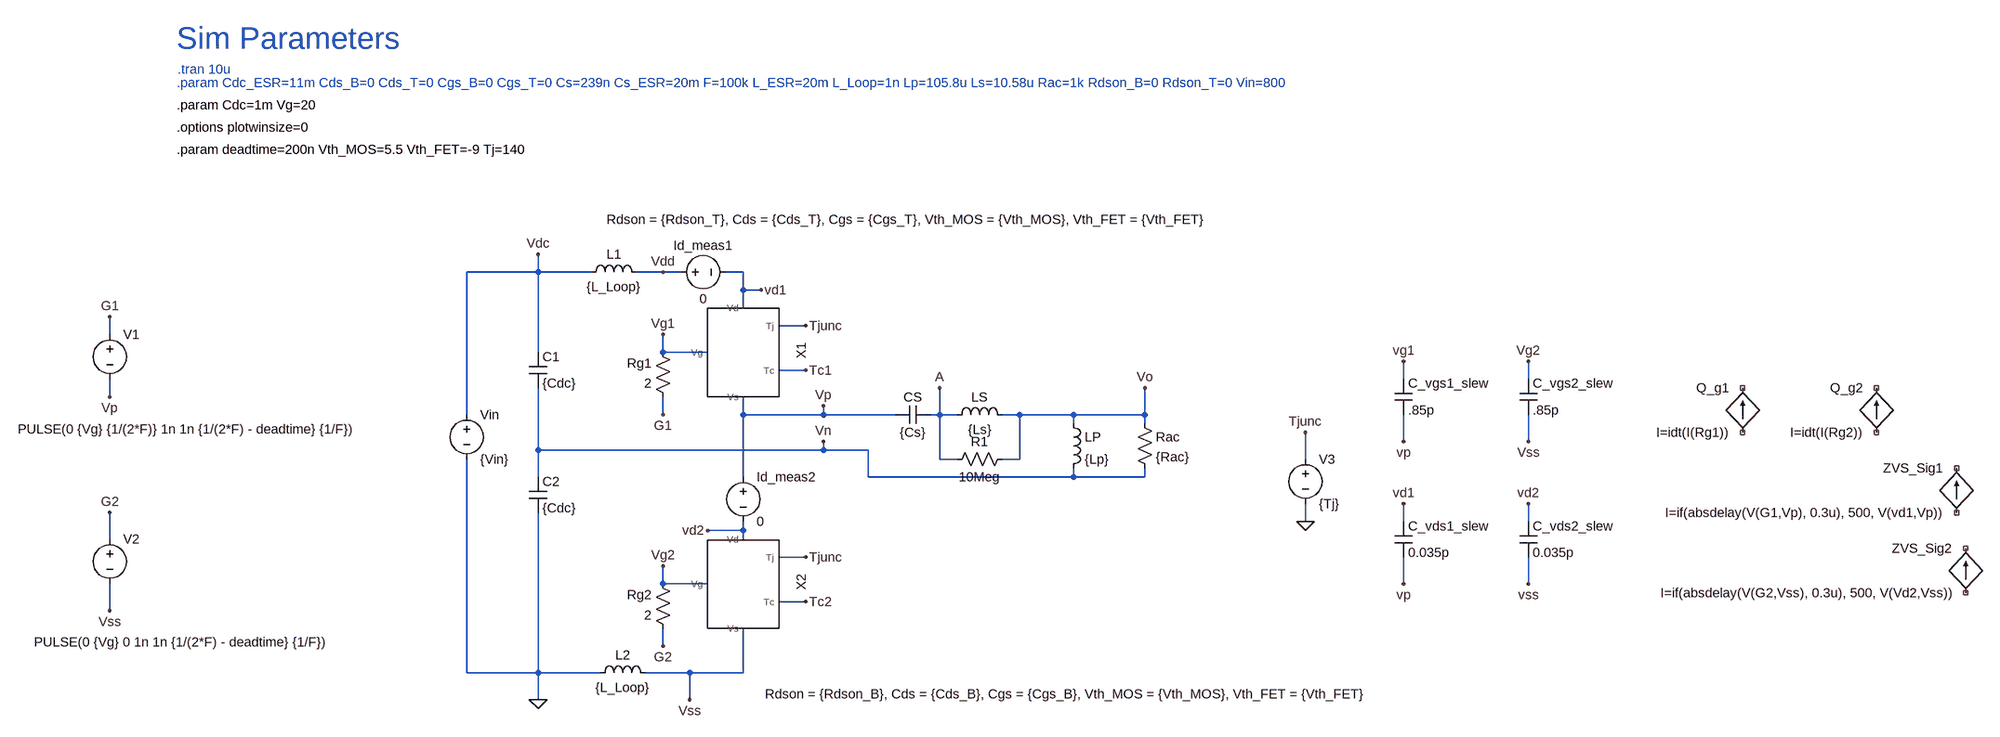
[diagram p0: schematic MainCircuit.asc]
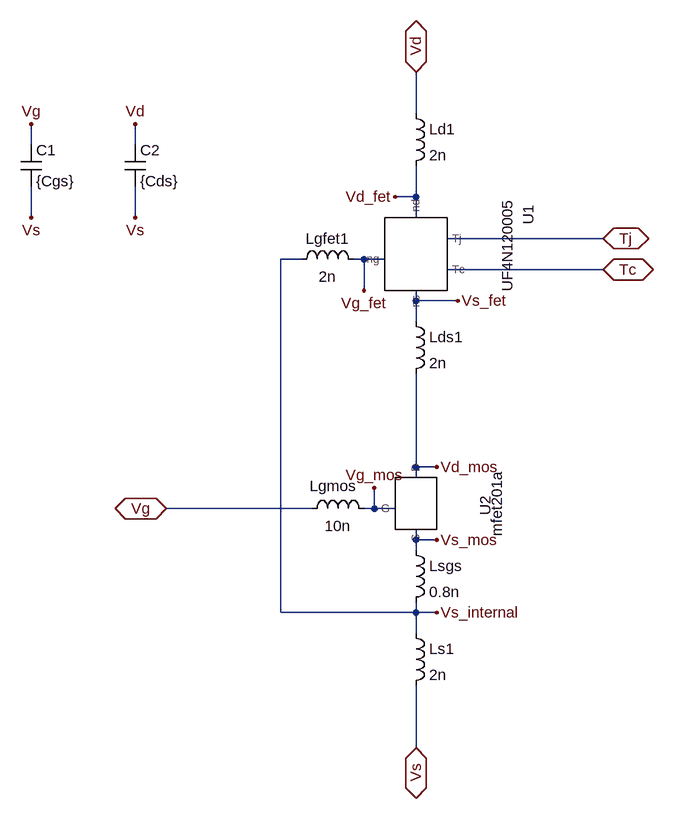
[diagram p1: sub-circuit ccjfet.asc]
MainCircuit.asc, the LTspice schematic file:
Version 4
SHEET 1 3076 1788
WIRE -1248 272 -1248 240
WIRE -1248 272 -1376 272
WIRE -1152 272 -1248 272
WIRE -1024 272 -1072 272
WIRE -992 272 -1024 272
WIRE -880 272 -912 272
WIRE -880 304 -880 272
WIRE -848 304 -880 304
WIRE -880 336 -880 304
WIRE -768 368 -816 368
WIRE -2016 384 -2016 352
WIRE -1248 416 -1248 272
WIRE -1024 416 -1024 384
WIRE -944 416 -1024 416
WIRE -768 448 -816 448
WIRE 304 464 304 432
WIRE 528 464 528 432
WIRE -2016 496 -2016 464
WIRE -1376 528 -1376 272
WIRE -1024 528 -1024 496
WIRE -880 528 -880 496
WIRE -736 528 -736 512
WIRE -736 528 -880 528
WIRE -608 528 -736 528
WIRE -528 528 -528 480
WIRE -528 528 -544 528
WIRE -496 528 -528 528
WIRE -384 528 -416 528
WIRE -288 528 -384 528
WIRE -160 528 -160 480
WIRE -160 528 -288 528
WIRE -288 544 -288 528
WIRE -160 544 -160 528
WIRE 304 576 304 528
WIRE 528 576 528 528
WIRE -1248 592 -1248 480
WIRE -736 592 -736 576
WIRE -736 592 -1248 592
WIRE -656 592 -736 592
WIRE -528 608 -528 528
WIRE -496 608 -528 608
WIRE -384 608 -384 528
WIRE -384 608 -416 608
WIRE 128 608 128 560
WIRE -1248 640 -1248 592
WIRE -880 640 -880 528
WIRE -656 640 -656 592
WIRE -288 640 -288 624
WIRE -288 640 -656 640
WIRE -160 640 -160 624
WIRE -160 640 -288 640
WIRE 128 720 128 688
WIRE 304 720 304 688
WIRE 528 720 528 688
WIRE -880 736 -880 720
WIRE -880 736 -944 736
WIRE -2016 752 -2016 704
WIRE -880 752 -880 736
WIRE -768 784 -816 784
WIRE -1024 832 -1024 800
WIRE -944 832 -1024 832
WIRE 304 832 304 784
WIRE 528 832 528 784
WIRE -768 864 -816 864
WIRE -2016 880 -2016 832
WIRE -1024 944 -1024 912
WIRE -1376 992 -1376 608
WIRE -1248 992 -1248 704
WIRE -1248 992 -1376 992
WIRE -1136 992 -1248 992
WIRE -976 992 -1056 992
WIRE -880 992 -880 912
WIRE -880 992 -976 992
WIRE -1248 1040 -1248 992
WIRE -976 1040 -976 992
FLAG -736 512 Vp
FLAG -736 576 Vn
FLAG -2016 352 G1
FLAG -2016 496 Vp
FLAG -2016 704 G2
FLAG -1248 240 Vdc
FLAG -160 480 Vo
FLAG -528 480 A
FLAG -1248 1040 0
FLAG -1024 528 G1
FLAG -1024 944 G2
FLAG -1024 384 Vg1
FLAG -1024 800 Vg2
FLAG -848 304 vd1
FLAG -944 736 vd2
FLAG -768 784 Tjunc
FLAG -768 368 Tjunc
FLAG -1024 272 Vdd
FLAG -976 1040 Vss
FLAG 528 576 Vss
FLAG 528 432 Vg2
FLAG 304 432 vg1
FLAG 304 576 vp
FLAG 304 688 vd1
FLAG 304 832 vp
FLAG 528 688 vd2
FLAG 528 832 vss
FLAG 128 720 0
FLAG 128 560 Tjunc
FLAG -2016 880 Vss
FLAG -768 448 Tc1
FLAG -768 864 Tc2
SYMBOL voltage -1376 512 R0
SYMATTR InstName Vin
SYMATTR Value {Vin}
SYMBOL cap -1264 416 R0
SYMATTR InstName C1
SYMATTR Value {Cdc}
SYMATTR SpiceLine Rser={Cdc_ESR}
SYMBOL cap -1264 640 R0
SYMATTR InstName C2
SYMATTR Value {Cdc}
SYMATTR SpiceLine Rser={Cdc_ESR}
SYMBOL ind -512 544 R270
WINDOW 0 32 56 VTop 2
WINDOW 3 5 56 VBottom 2
SYMATTR InstName LS
SYMATTR Value {Ls}
SYMATTR SpiceLine Rser={Ls_ESR}
SYMBOL ind -304 528 R0
SYMATTR InstName LP
SYMATTR Value {Lp}
SYMATTR SpiceLine Rser={Lp_ESR}
SYMBOL cap -608 544 R270
WINDOW 0 32 32 VTop 2
WINDOW 3 0 32 VBottom 2
SYMATTR InstName CS
SYMATTR Value {Cs}
SYMATTR SpiceLine Rser={Cs_ESR}
SYMBOL res -176 528 R0
SYMATTR InstName Rac
SYMATTR Value {Rac}
SYMBOL voltage -2016 368 R0
WINDOW 3 -165 186 Left 2
WINDOW 123 0 0 Left 0
WINDOW 39 0 0 Left 0
SYMATTR Value PULSE(0 {Vg} {1/(2*F)} 1n 1n {1/(2*F) - deadtime} {1/F})
SYMATTR InstName V1
SYMBOL voltage -2016 736 R0
WINDOW 3 -136 201 Left 2
WINDOW 123 0 0 Left 0
WINDOW 39 0 0 Left 0
SYMATTR Value PULSE(0 {Vg} 0 1n 1n {1/(2*F) - deadtime} {1/F})
SYMATTR InstName V2
SYMBOL res -1008 928 R180
WINDOW 0 36 76 Left 2
WINDOW 3 36 40 Left 2
SYMATTR InstName Rg2
SYMATTR Value 2
SYMBOL res -1008 512 R180
WINDOW 0 36 76 Left 2
WINDOW 3 36 40 Left 2
SYMATTR InstName Rg1
SYMATTR Value 2
SYMBOL CCJFET -896 384 R0
WINDOW 39 306 -191 Bottom 2
SYMATTR SpiceLine Rdson = {Rdson_T}, Cds = {Cds_T}, Cgs = {Cgs_T}, Vth_MOS = {Vth_MOS}, Vth_FET = {Vth_FET}
SYMATTR InstName X1
SYMATTR ModelFile C:\Users\Nick\Desktop\ThesisSim\FullSim\CCJFET.txt
SYMBOL CCJFET -896 800 R0
WINDOW 39 591 246 Bottom 2
SYMATTR SpiceLine Rdson = {Rdson_B}, Cds = {Cds_B}, Cgs = {Cgs_B}, Vth_MOS = {Vth_MOS}, Vth_FET = {Vth_FET}
SYMATTR InstName X2
SYMATTR ModelFile C:\Users\Nick\Desktop\ThesisSim\FullSim\CCJFET.txt
SYMBOL voltage -1008 272 R270
WINDOW 0 32 56 VTop 2
WINDOW 3 -32 56 VBottom 2
WINDOW 123 0 0 Left 0
WINDOW 39 0 0 Left 0
SYMATTR InstName Id_meas1
SYMATTR Value 0
SYMBOL voltage -880 624 R0
WINDOW 123 0 0 Left 0
WINDOW 39 0 0 Left 0
SYMATTR InstName Id_meas2
SYMATTR Value 0
SYMBOL ind -1168 288 R270
WINDOW 0 32 56 VTop 2
WINDOW 3 5 56 VBottom 2
SYMATTR InstName L1
SYMATTR Value {L_Loop}
SYMBOL ind -1152 1008 R270
WINDOW 0 32 56 VTop 2
WINDOW 3 5 56 VBottom 2
SYMATTR InstName L2
SYMATTR Value {L_Loop}
SYMBOL cap 288 464 R0
SYMATTR InstName C_vgs1_slew
SYMATTR Value .85p
SYMBOL cap 512 464 R0
SYMATTR InstName C_vgs2_slew
SYMATTR Value .85p
SYMBOL cap 288 720 R0
SYMATTR InstName C_vds1_slew
SYMATTR Value 0.035p
SYMBOL cap 512 720 R0
SYMATTR InstName C_vds2_slew
SYMATTR Value 0.035p
SYMBOL voltage 128 592 R0
WINDOW 123 0 0 Left 0
WINDOW 39 0 0 Left 0
SYMATTR InstName V3
SYMATTR Value {Tj}
SYMBOL res -400 592 R90
WINDOW 0 0 56 VBottom 2
WINDOW 3 32 56 VTop 2
SYMATTR InstName R1
SYMATTR Value 10Meg
SYMBOL bi 912 560 R180
WINDOW 0 24 80 Left 2
WINDOW 3 24 0 Left 2
SYMATTR InstName Q_g1
SYMATTR Value I=idt(I(Rg1))
SYMBOL bi 1152 560 R180
WINDOW 0 24 80 Left 2
WINDOW 3 24 0 Left 2
SYMATTR InstName Q_g2
SYMATTR Value I=idt(I(Rg2))
SYMBOL bi 1296 704 R180
WINDOW 0 24 80 Left 2
WINDOW 3 24 0 Left 2
SYMATTR InstName ZVS_Sig1
SYMATTR Value I=if(absdelay(V(G1,Vp), 0.3u), 500, V(vd1,Vp))
SYMBOL bi 1312 848 R180
WINDOW 0 24 80 Left 2
WINDOW 3 24 0 Left 2
SYMATTR InstName ZVS_Sig2
SYMATTR Value I=if(absdelay(V(G2,Vss), 0.3u), 500, V(Vd2,Vss))
TEXT -1896 -272 Left 5 ;Sim Parameters
TEXT -1896 -192 Left 2 ;.param Cdc_ESR=11m Cds_B=0 Cds_T=0 Cgs_B=0 Cgs_T=0 Cs=239n Cs_ESR=20m F=100k L_ESR=20m L_Loop=1n Lp=105.8u Ls=10.58u Rac=1k Rdson_B=0 Rdson_T=0 Vin=800
TEXT -1896 -112 Left 2 !.options plotwinsize=0
TEXT -1896 -152 Left 2 !.param Cdc=1m Vg=20
TEXT -1896 -72 Left 2 !.param deadtime=200n Vth_MOS=5.5 Vth_FET=-9 Tj=140
TEXT -1894 -216 Left 2 ;.tran 10u

ccjfet.asc, the sub-circuit schematic file:
Version 4
SHEET 1 880 776
WIRE 240 -288 240 -352
WIRE -352 -240 -352 -272
WIRE -192 -240 -192 -272
WIRE 240 -160 240 -208
WIRE 240 -160 208 -160
WIRE -352 -128 -352 -176
WIRE -192 -128 -192 -176
WIRE 240 -128 240 -160
WIRE 528 -96 288 -96
WIRE 64 -64 32 -64
WIRE 160 -64 144 -64
WIRE 192 -64 160 -64
WIRE 528 -48 288 -48
WIRE 160 -16 160 -64
WIRE 240 0 240 -16
WIRE 304 0 240 0
WIRE 240 32 240 0
WIRE 240 256 240 112
WIRE 272 256 240 256
WIRE 240 272 240 256
WIRE 80 320 -144 320
WIRE 176 320 176 288
WIRE 176 320 160 320
WIRE 208 320 176 320
WIRE 240 368 240 352
WIRE 272 368 240 368
WIRE 240 384 240 368
WIRE 32 480 32 -64
WIRE 240 480 240 464
WIRE 240 480 32 480
WIRE 272 480 240 480
WIRE 240 512 240 480
WIRE 240 688 240 592
FLAG 176 288 Vg_mos
FLAG 208 -160 Vd_fet
FLAG 160 -16 Vg_fet
FLAG 304 0 Vs_fet
FLAG 272 256 Vd_mos
FLAG 272 368 Vs_mos
FLAG 272 480 Vs_internal
FLAG 528 -96 Tj
IOPIN 528 -96 BiDir
FLAG 528 -48 Tc
IOPIN 528 -48 BiDir
FLAG 240 -352 Vd
IOPIN 240 -352 BiDir
FLAG 240 688 Vs
IOPIN 240 688 BiDir
FLAG -144 320 Vg
IOPIN -144 320 BiDir
FLAG -352 -272 Vg
FLAG -352 -128 Vs
FLAG -192 -272 Vd
FLAG -192 -128 Vs
SYMBOL ind 224 368 R0
SYMATTR InstName Lsgs
SYMATTR Value 0.8n
SYMBOL ind 224 496 R0
SYMATTR InstName Ls1
SYMATTR Value 2n
SYMBOL ind 64 336 R270
WINDOW 0 35 49 VTop 2
WINDOW 3 5 56 VBottom 2
SYMATTR InstName Lgmos
SYMATTR Value 10n
SYMBOL ind 224 -304 R0
SYMATTR InstName Ld1
SYMATTR Value 2n
SYMBOL ind 48 -48 R270
WINDOW 0 32 56 VTop 2
WINDOW 3 5 56 VBottom 2
SYMATTR InstName Lgfet1
SYMATTR Value 2n
SYMBOL ind 224 16 R0
SYMATTR InstName Lds1
SYMATTR Value 2n
SYMATTR SpiceLine Rser={Rdson}
SYMBOL cap -368 -240 R0
SYMATTR InstName C1
SYMATTR Value {Cgs}
SYMBOL cap -208 -240 R0
SYMATTR InstName C2
SYMATTR Value {Cds}
SYMBOL UF4N120005 240 -80 R0
WINDOW 0 157 -52 VTop 2
SYMATTR InstName U1
SYMATTR SpiceLine Vth = {Vth_FET}
SYMATTR ModelFile C:\Users\Nick\Desktop\ThesisSim\FullSim\Vth_Step\UF4N120005_ET_A.txt
SYMBOL mfet201a 240 320 R0
WINDOW 0 91 -4 VTop 2
SYMATTR InstName U2
SYMATTR SpiceLine Vth = {Vth_MOS}
SYMATTR ModelFile C:\Users\Nick\Desktop\ThesisSim\FullSim\Vth_Step\mosfetuni.txt

The netlist it stands for:
* MainCircuit.asc
Vin Vdc 0 {Vin}
C1 Vdc Vn {Cdc} Rser={Cdc_ESR}
C2 Vn 0 {Cdc} Rser={Cdc_ESR}
LS A Vo {Ls} Rser={Ls_ESR}
LP Vo Vn {Lp} Rser={Lp_ESR}
CS Vp A {Cs} Rser={Cs_ESR}
Rac Vo Vn {Rac}
V1 G1 Vp PULSE(0 {Vg} {1/(2*F)} 1n 1n {1/(2*F) - deadtime} {1/F})
V2 G2 Vss PULSE(0 {Vg} 0 1n 1n {1/(2*F) - deadtime} {1/F})
Rg2 G2 Vg2 2
Rg1 G1 Vg1 2
XX1 Tc1 Tjunc vd1 Vg1 Vp ccjfet params: CCJFET Rdson = {Rdson_T}, Cds = {Cds_T}, Cgs = {Cgs_T}, Vth_MOS = {Vth_MOS}, Vth_FET = {Vth_FET}
XX2 Tc2 Tjunc vd2 Vg2 Vss ccjfet params: CCJFET Rdson = {Rdson_B}, Cds = {Cds_B}, Cgs = {Cgs_B}, Vth_MOS = {Vth_MOS}, Vth_FET = {Vth_FET}
V§Id_meas1 Vdd vd1 0
V§Id_meas2 Vp vd2 0
L1 Vdc Vdd {L_Loop}
L2 0 Vss {L_Loop}
C_vgs1_slew Vg1 Vp .85p
C_vgs2_slew Vg2 Vss .85p
C_vds1_slew vd1 Vp 0.035p
C_vds2_slew vd2 Vss 0.035p
V3 Tjunc 0 {Tj}
R1 Vo A 10Meg
B§Q_g1 NC_01 NC_02 I=idt(I(Rg1))
B§Q_g2 NC_03 NC_04 I=idt(I(Rg2))
B§ZVS_Sig1 NC_05 NC_06 I=if(absdelay(V(G1,Vp), 0.3u), 500, V(vd1,Vp))
B§ZVS_Sig2 NC_07 NC_08 I=if(absdelay(V(G2,Vss), 0.3u), 500, V(Vd2,Vss))

* block symbol definitions
.subckt ccjfet Tc Tj Vd Vg Vs
Lsgs Vs_mos Vs_internal 0.8n
Ls1 Vs_internal Vs 2n
Lgmos Vg Vg_mos 10n
Ld1 Vd Vd_fet 2n
Lgfet1 Vs_internal Vg_fet 2n
Lds1 Vs_fet Vd_mos 2n Rser={Rdson}
C1 Vg Vs {Cgs}
C2 Vd Vs {Cds}
XU1 Vd_fet Vg_fet Vs_fet Tj Tc UF4N120005 Vth = {Vth_FET}  ; pins nd ng ns Tj Tc
XU2 Vd_mos Vg_mos Vs_mos mfet201a Vth = {Vth_MOS}  ; pins D G S
.ends ccjfet

* Sim Parameters
* .param Cdc_ESR=11m Cds_B=0 Cds_T=0 Cgs_B=0 Cgs_T=0 Cs=239n Cs_ESR=20m F=100k L_ESR=20m L_Loop=1n Lp=105.8u Ls=10.58u Rac=1k Rdson_B=0 Rdson_T=0 Vin=800
.options plotwinsize=0
.param Cdc=1m Vg=20
.param deadtime=200n Vth_MOS=5.5 Vth_FET=-9 Tj=140
* .tran 10u
.lib C:\Users\Nick\Desktop\ThesisSim\FullSim\CCJFET.txt
.lib C:\Users\Nick\Desktop\ThesisSim\FullSim\Vth_Step\UF4N120005_ET_A.txt
.lib C:\Users\Nick\Desktop\ThesisSim\FullSim\Vth_Step\mosfetuni.txt
.backanno
.end